# EAGLE schematic caretaker-rotaryknob (EAGLE 6.5.0)
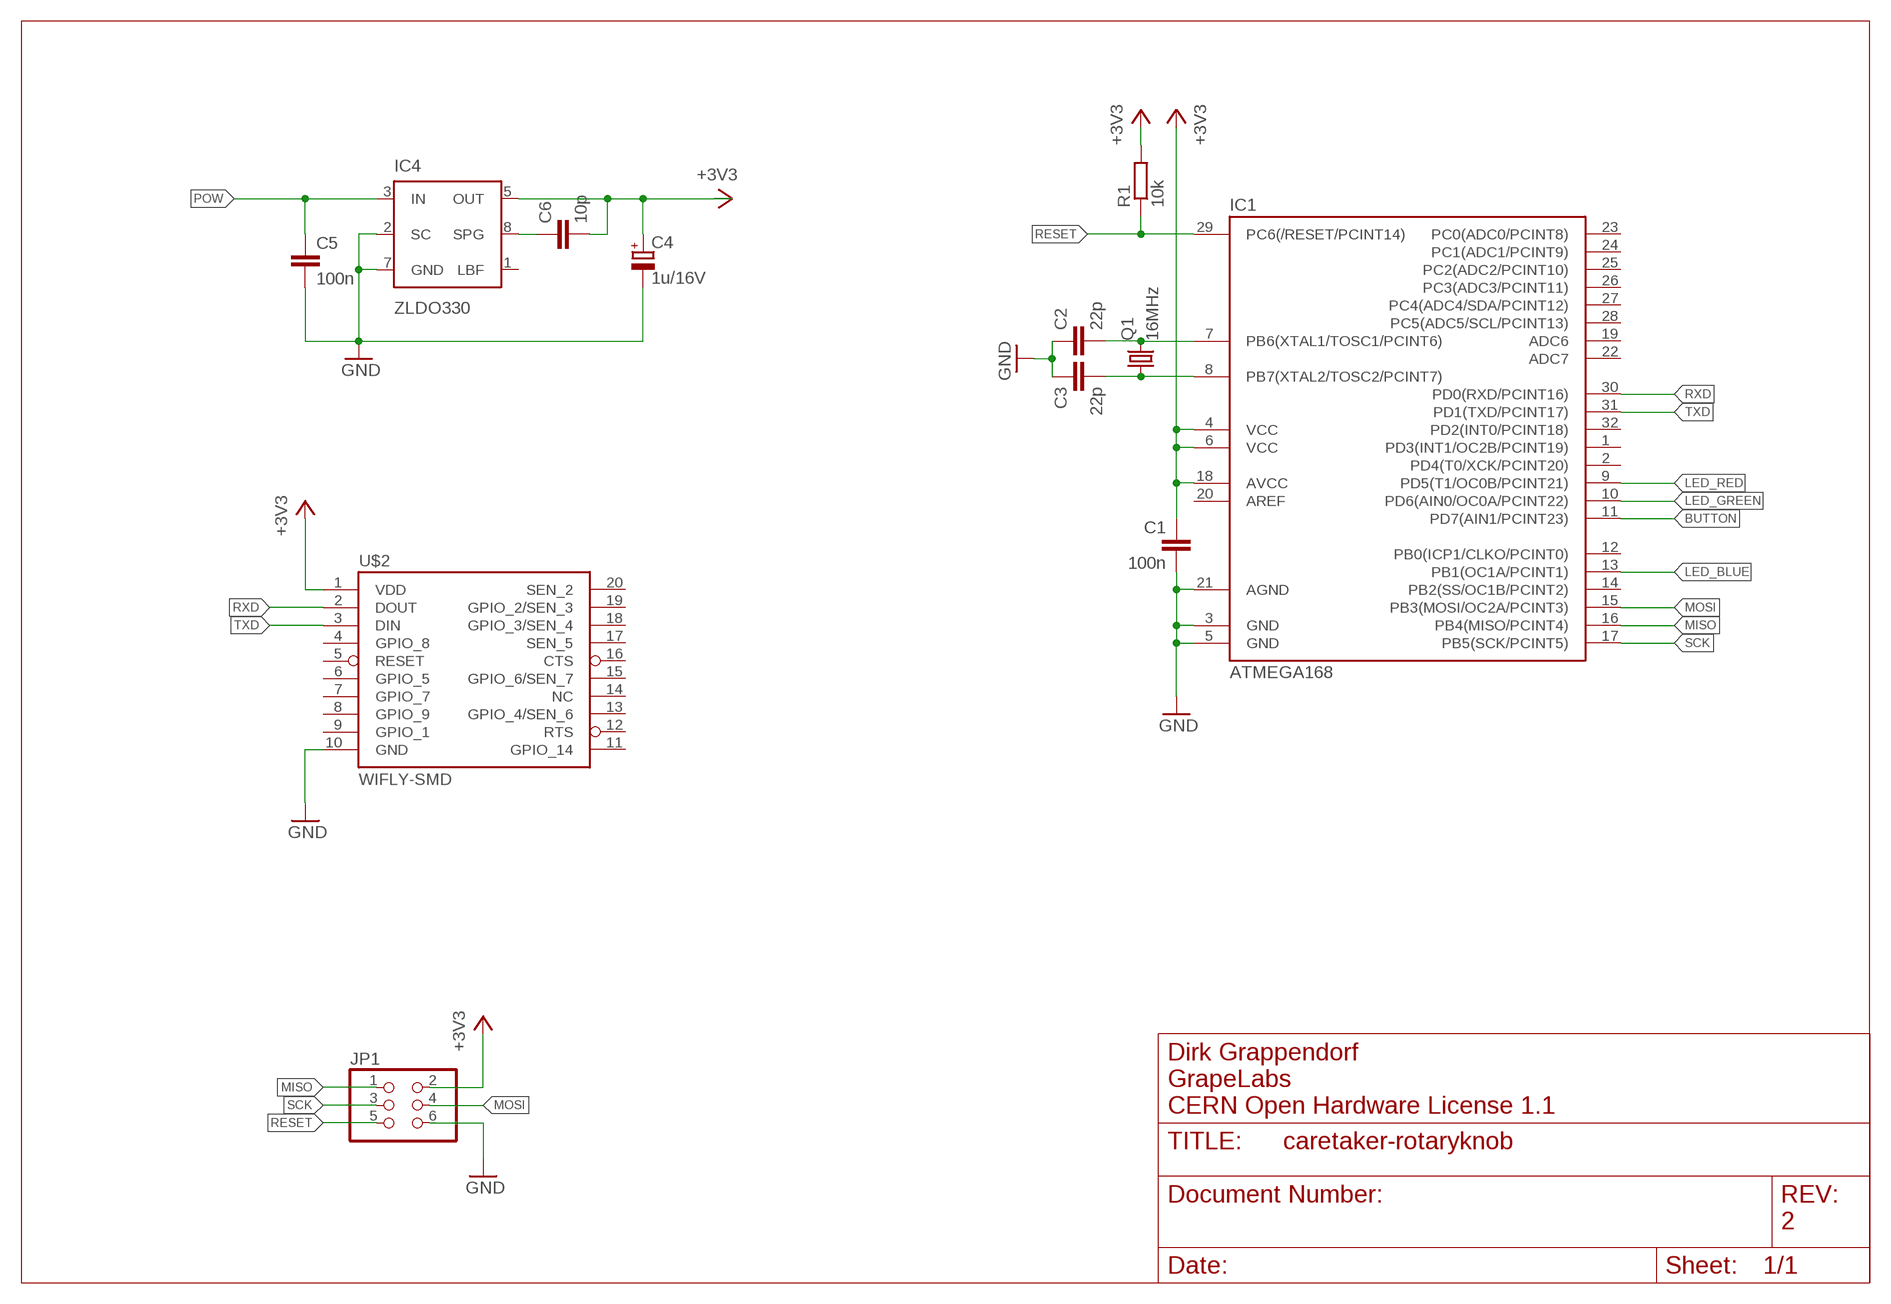
[diagram p0: schematic, sheet 1]

## Parts
C1  100n  C-EUC1206K  [C1206K]
C2  22p  C-EUC1206K  [C1206K]
C3  22p  C-EUC1206K  [C1206K]
C4  1u/16V  CPOL-EUB  [PANASONIC_B]
C5  100n  C-EUC1206  [C1206]
C6  10p  C-EUC1206  [C1206]
IC1  ATMEGA168  ATMEGA48/88/168-AU  [TQFP32-08]
IC4  ZLDO330  [SM8]
JP1  PINHD-2X3_2.54-SMD  [2X03SMD]
Q1  16MHz  CRYSTALHC49UP  [HC49UP]
R1  10k  R-EU_M1206  [M1206]
U$2  WIFLY-SMD  [WIFLY-SMD]

## Nets
+3V3: C1.1 C4.+ C6.2 IC1.4(VCC) IC1.6(VCC) IC1.18(AVCC) IC4.5(OUT) JP1.2 R1.2 U$2.1(VDD)
BUTTON: IC1.11(PD7(AIN1/PCINT23))
GND: C1.2 C2.1 C3.1 C4.- C5.2 IC1.3(GND) IC1.5(GND) IC1.21(AGND) IC4.2(SC) IC4.7(GND) JP1.6 U$2.10(GND)
LED_BLUE: IC1.13(PB1(OC1A/PCINT1))
LED_GREEN: IC1.10(PD6(AIN0/OC0A/PCINT22))
LED_RED: IC1.9(PD5(T1/OC0B/PCINT21))
MISO: IC1.16(PB4(MISO/PCINT4)) JP1.1
MOSI: IC1.15(PB3(MOSI/OC2A/PCINT3)) JP1.4
N$3: C2.2 IC1.7(PB6(XTAL1/TOSC1/PCINT6)) Q1.2
N$4: C3.2 IC1.8(PB7(XTAL2/TOSC2/PCINT7)) Q1.1
N$15: C6.1 IC4.8(SPG)
POW: C5.1 IC4.3(IN)
RESET: IC1.29(PC6(/RESET/PCINT14)) JP1.5 R1.1
RXD: IC1.30(PD0(RXD/PCINT16)) U$2.2(DOUT)
SCK: IC1.17(PB5(SCK/PCINT5)) JP1.3
TXD: IC1.31(PD1(TXD/PCINT17)) U$2.3(DIN)
Unconnected: IC1.1(PD3(INT1/OC2B/PCINT19)) IC1.2(PD4(T0/XCK/PCINT20)) IC1.12(PB0(ICP1/CLKO/PCINT0)) IC1.14(PB2(SS/OC1B/PCINT2)) IC1.19(ADC6) IC1.20(AREF) IC1.22(ADC7) IC1.23(PC0(ADC0/PCINT8)) IC1.24(PC1(ADC1/PCINT9)) IC1.25(PC2(ADC2/PCINT10)) IC1.26(PC3(ADC3/PCINT11)) IC1.27(PC4(ADC4/SDA/PCINT12)) IC1.28(PC5(ADC5/SCL/PCINT13)) IC1.32(PD2(INT0/PCINT18)) IC4.1(LBF) U$2.4(GPIO_8) U$2.5(RESET) U$2.6(GPIO_5) U$2.7(GPIO_7) U$2.8(GPIO_9) U$2.9(GPIO_1) U$2.11(GPIO_14) U$2.12(RTS) U$2.13(GPIO_4/SEN_6) U$2.14(NC) U$2.15(GPIO_6/SEN_7) U$2.16(CTS) U$2.17(SEN_5) U$2.18(GPIO_3/SEN_4) U$2.19(GPIO_2/SEN_3) U$2.20(SEN_2)

## Notes on the sheet
- Dirk Grappendorf
- GrapeLabs
- CERN Open Hardware License 1.1
- 2

## Library data of the parts
C1-C3 C5 C6 = rcl:C-EU: CAPACITOR, European symbol
C4 = rcl:CPOL-EU: POLARIZED CAPACITOR, European symbol
IC1 = atmega8:ATMEGA48/88/168
IC4 = grapelabs:ZLDO330
JP1 = pinhead-1:PINHD-2X3: PIN HEADER
Q1 = crystal:CRYSTAL: CRYSTAL
R1 = rcl:R-EU_: RESISTOR, European symbol
U$2 = grapelabs:WIFLY